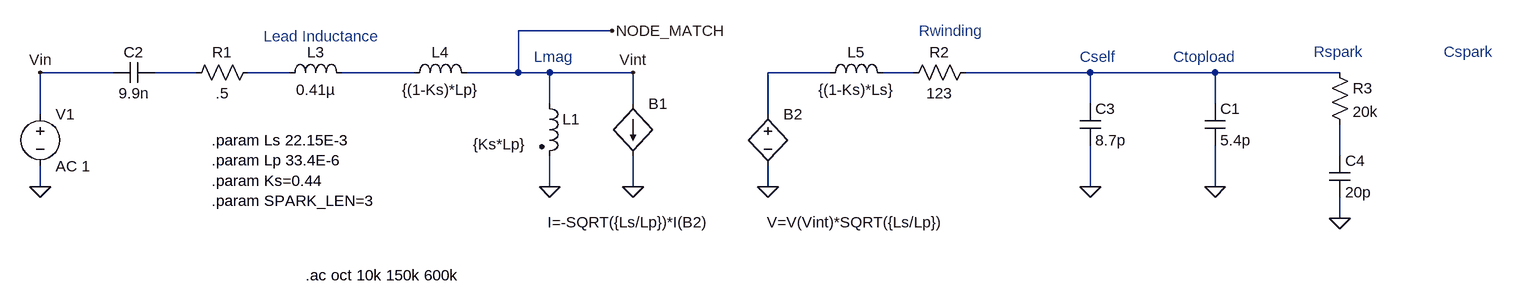
[diagram p0: schematic tesla_coil_freq_fit_v2_alt.asc]
tesla_coil_freq_fit_v2_alt.asc, the LTspice schematic file:
Version 4
SHEET 1 2020 680
WIRE 464 32 320 32
WIRE -304 96 -416 96
WIRE -176 96 -240 96
WIRE -32 96 -96 96
WIRE 160 96 48 96
WIRE 320 96 320 32
WIRE 320 96 240 96
WIRE 368 96 320 96
WIRE 496 96 368 96
WIRE 800 96 704 96
WIRE 928 96 880 96
WIRE 1200 96 1008 96
WIRE 1392 96 1200 96
WIRE 1584 96 1392 96
WIRE 368 144 368 96
WIRE 496 144 496 96
WIRE 1200 144 1200 96
WIRE 1392 144 1392 96
WIRE -416 160 -416 96
WIRE 704 160 704 96
WIRE 1584 224 1584 176
WIRE -416 272 -416 240
WIRE 368 272 368 224
WIRE 496 272 496 224
WIRE 704 272 704 240
WIRE 1200 272 1200 208
WIRE 1392 272 1392 208
WIRE 1584 320 1584 288
FLAG 1392 272 0
FLAG 368 272 0
FLAG -416 272 0
FLAG 1200 272 0
FLAG 704 272 0
FLAG 496 272 0
FLAG 496 96 Vint
FLAG -416 96 Vin
FLAG 464 32 NODE_MATCH
FLAG 1584 320 0
SYMBOL ind2 352 128 R0
WINDOW 3 -102 78 Left 2
SYMATTR Value {Ks*Lp}
SYMATTR InstName L1
SYMATTR Type ind
SYMBOL res -80 80 R90
WINDOW 0 0 56 VBottom 2
WINDOW 3 32 56 VTop 2
SYMATTR InstName R1
SYMATTR Value .5
SYMBOL res 1024 80 R90
WINDOW 0 0 56 VBottom 2
WINDOW 3 32 56 VTop 2
SYMATTR InstName R2
SYMATTR Value 123
SYMBOL cap -240 80 R90
WINDOW 0 0 32 VBottom 2
WINDOW 3 32 32 VTop 2
SYMATTR InstName C2
SYMATTR Value 9.9n
SYMBOL cap 1376 144 R0
SYMATTR InstName C1
SYMATTR Value 5.4p
SYMBOL voltage -416 144 R0
SYMATTR InstName V1
SYMATTR Value AC 1
SYMBOL ind -48 112 R270
WINDOW 0 32 56 VTop 2
WINDOW 3 5 56 VBottom 2
SYMATTR InstName L3
SYMATTR Value 0.41µ
SYMBOL cap 1184 144 R0
SYMATTR InstName C3
SYMATTR Value 8.7p
SYMBOL ind 144 112 R270
WINDOW 0 32 56 VTop 2
WINDOW 3 5 56 VBottom 2
SYMATTR InstName L4
SYMATTR Value {(1-Ks)*Lp}
SYMBOL ind 784 112 R270
WINDOW 0 32 56 VTop 2
WINDOW 3 5 56 VBottom 2
SYMATTR InstName L5
SYMATTR Value {(1-Ks)*Ls}
SYMBOL bi 496 144 R0
WINDOW 3 -131 182 Left 2
SYMATTR Value I=-SQRT({Ls/Lp})*I(B2)
SYMATTR InstName B1
SYMBOL bv 704 144 R0
WINDOW 3 -2 182 Left 2
SYMATTR Value V=V(Vint)*SQRT({Ls/Lp})
SYMATTR InstName B2
SYMBOL res 1568 80 R0
SYMATTR InstName R3
SYMATTR Value 20k
SYMBOL cap 1568 224 R0
SYMATTR InstName C4
SYMATTR Value 20p
TEXT -8 408 Left 2 !.ac oct 10k 150k 600k
TEXT 1184 72 Left 2 ;Cself
TEXT 1328 72 Left 2 ;Ctopload
TEXT -72 40 Left 2 ;Lead Inductance
TEXT -152 200 Left 2 !.param Ls 22.15E-3\n.param Lp 33.4E-6\n.param Ks=0.44\n.param SPARK_LEN=3
TEXT 1544 64 Left 2 ;Rspark
TEXT 1744 64 Left 2 ;Cspark
TEXT 344 72 Left 2 ;Lmag
TEXT 936 32 Left 2 ;Rwinding

The netlist it stands for:
* tesla_coil_freq_fit_v2_alt.asc
L1 NODE_MATCH 0 {Ks*Lp}
R1 N002 N001 .5
R2 N006 N005 123
C2 N001 Vin 9.9n
C1 N006 0 5.4p
V1 Vin 0 AC 1
L3 N002 N003 0.41µ
C3 N006 0 8.7p
L4 N003 NODE_MATCH {(1-Ks)*Lp}
L5 N004 N005 {(1-Ks)*Ls}
B1 NODE_MATCH 0 I=-SQRT({Ls/Lp})*I(B2)
B2 N004 0 V=V(Vint)*SQRT({Ls/Lp})
R3 N006 N007 20k
C4 N007 0 20p
.ac oct 10k 150k 600k
* Cself
* Ctopload
* Lead Inductance
.param Ls 22.15E-3
.param Lp 33.4E-6
.param Ks=0.44
.param SPARK_LEN=3
* Rspark
* Cspark
* Lmag
* Rwinding
.backanno
.end